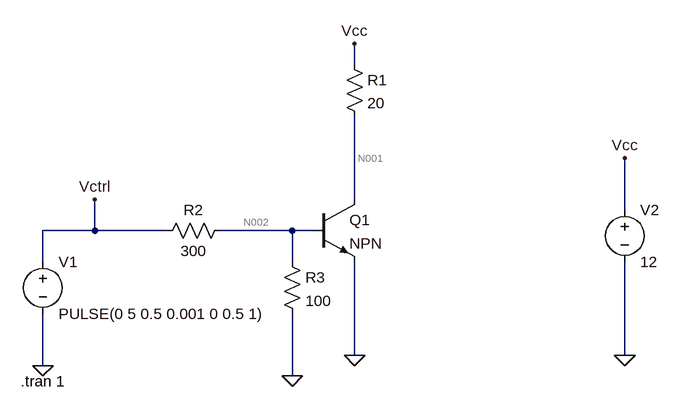
[diagram p0: schematic npn.asc]
npn.asc, the LTspice schematic file:
Version 4
SHEET 1 880 680
WIRE 208 -112 208 -144
WIRE 208 96 208 -32
WIRE 624 112 624 32
WIRE -192 144 -192 96
WIRE -192 144 -272 144
WIRE -80 144 -192 144
WIRE 112 144 0 144
WIRE 144 144 112 144
WIRE -272 192 -272 144
WIRE 112 192 112 144
WIRE 208 336 208 192
WIRE 624 336 624 192
WIRE -272 352 -272 272
WIRE 112 368 112 272
FLAG -272 352 0
FLAG 208 336 0
FLAG 624 32 Vcc
FLAG 624 336 0
FLAG 208 -144 Vcc
FLAG -192 96 Vctrl
FLAG 112 368 0
SYMBOL npn 144 96 R0
SYMATTR InstName Q1
SYMBOL voltage -272 176 R0
WINDOW 123 0 0 Left 0
WINDOW 39 0 0 Left 0
SYMATTR InstName V1
SYMATTR Value PULSE(0 5 0.5 0.001 0 0.5 1)
SYMBOL res 192 -128 R0
SYMATTR InstName R1
SYMATTR Value 20
SYMBOL voltage 624 96 R0
WINDOW 123 0 0 Left 0
WINDOW 39 0 0 Left 0
SYMATTR InstName V2
SYMATTR Value 12
SYMBOL res 16 128 R90
WINDOW 0 0 56 VBottom 2
WINDOW 3 32 56 VTop 2
SYMATTR InstName R2
SYMATTR Value 300
SYMBOL res 96 176 R0
SYMATTR InstName R3
SYMATTR Value 100
TEXT -306 376 Left 2 !.tran 1

The netlist it stands for:
* npn.asc
Q1 N001 N002 0 0 NPN
V1 Vctrl 0 PULSE(0 5 0.5 0.001 0 0.5 1)
R1 Vcc N001 20
V2 Vcc 0 12
R2 N002 Vctrl 300
R3 N002 0 100
.model NPN NPN
.model PNP PNP
.lib standard.bjt
.tran 1
.backanno
.end

* Results of the author's LTspice run, read from the files saved beside the schematic
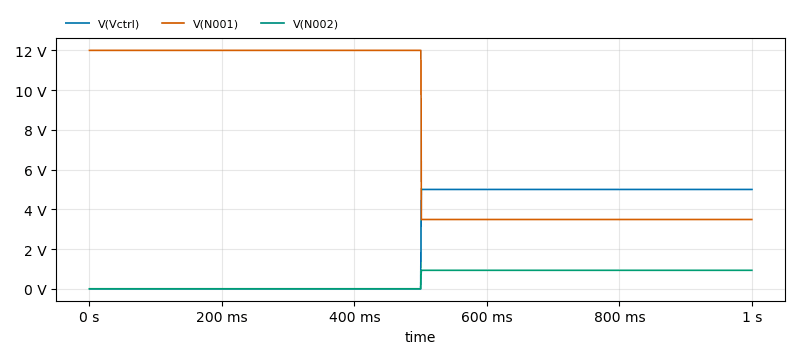
[diagram p1: Transient Analysis of npn.asc, plotted from the saved traces]
* Transient Analysis, 1 run:
*   V(Vctrl): min 0 V, max 5 V, average 2.498 V, rms 3.533 V, last 5 V
*   V(N001): min 3.488 V, max 12 V, average 7.75 V, rms 8.842 V, last 3.488 V
*   V(N002): min 0 V, max 930.8 mV, average 465 mV, rms 657.8 mV, last 930.8 mV